# Altium schematic sheet DSPCONN.SCHDOC
size B
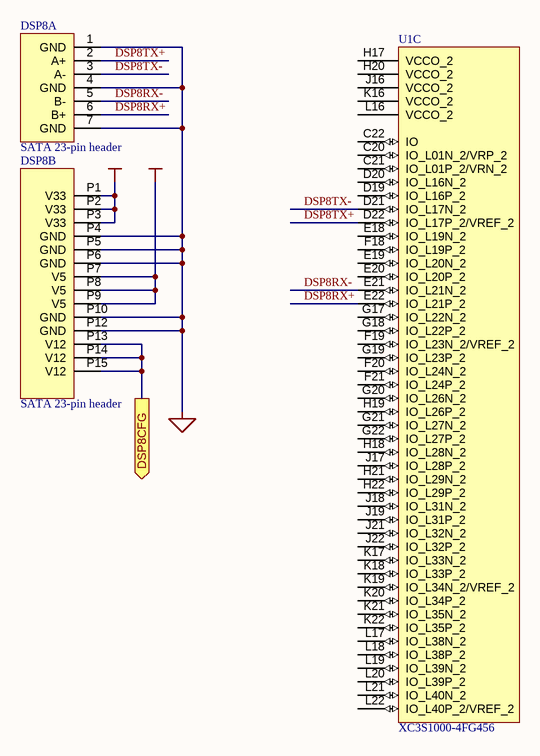
[diagram p0: DSPCONN.SCHDOC]

## Parts
DSP8  SATA 23-pin header  [MOLEX 87713-1001]  (parts A,B of 2)
U1  XC3S1000-4FG456  [FG456]  (part C of 9)

## Ports
DSP8CFG (out)

## Nets
+5VCC: DSP8.P7(V5) DSP8.P8(V5) DSP8.P9(V5)
GND: DSP8.1(GND) DSP8.4(GND) DSP8.7(GND) DSP8.P4(GND) DSP8.P5(GND) DSP8.P6(GND) DSP8.P10(GND) DSP8.P12(GND)
VCC: DSP8.P1(V33) DSP8.P2(V33) DSP8.P3(V33)
DSP8CFG: DSP8.P13(V12) DSP8.P14(V12) DSP8.P15(V12) ; port DSP8CFG
DSP8RX+: DSP8.6(B+) U1.E22(IO_L21P_2)
DSP8RX-: DSP8.5(B-) U1.E21(IO_L21N_2)
DSP8TX+: DSP8.2(A+) U1.D22(IO_L17P_2/VREF_2)
DSP8TX-: DSP8.3(A-) U1.D21(IO_L17N_2)

Not connected (* = marked no-connect by the designer): U1 C20(IO_L01N_2/VRP_2) C21(IO_L01P_2/VRN_2) C22(IO) D19(IO_L16P_2) D20(IO_L16N_2) E18(IO_L19N_2) E19(IO_L20N_2) E20(IO_L20P_2) F18(IO_L19P_2) F19(IO_L23N_2/VREF_2) F20(IO_L24N_2) F21(IO_L24P_2) G17(IO_L22N_2) G18(IO_L22P_2) G19(IO_L23P_2) G20(IO_L26N_2) G21(IO_L27N_2) G22(IO_L27P_2) H17(VCCO_2) H18(IO_L28N_2) H19(IO_L26P_2) H20(VCCO_2) H21(IO_L29N_2) H22(IO_L29P_2) J16(VCCO_2) J17(IO_L28P_2) J18(IO_L31N_2) J19(IO_L31P_2) J21(IO_L32N_2) J22(IO_L32P_2) K16(VCCO_2) K17(IO_L33N_2) K18(IO_L33P_2) K19(IO_L34N_2/VREF_2) K20(IO_L34P_2) K21(IO_L35N_2) K22(IO_L35P_2) L16(VCCO_2) L17(IO_L38N_2) L18(IO_L38P_2) L19(IO_L39N_2) L20(IO_L39P_2) L21(IO_L40N_2) L22(IO_L40P_2/VREF_2)

## Notes on the sheet
- Title:
- Engineer:
- Date:
- Revision:
- Sheet
- of
- File:

## Library data of the parts
DSP8 = SATA-23
U1 = XC3S1000-4FG456: Xilinx Spartan-3 FPGA; Vendor: Xilinx